# EAGLE schematic Main_V4.1_v37 (EAGLE 9.7.0)
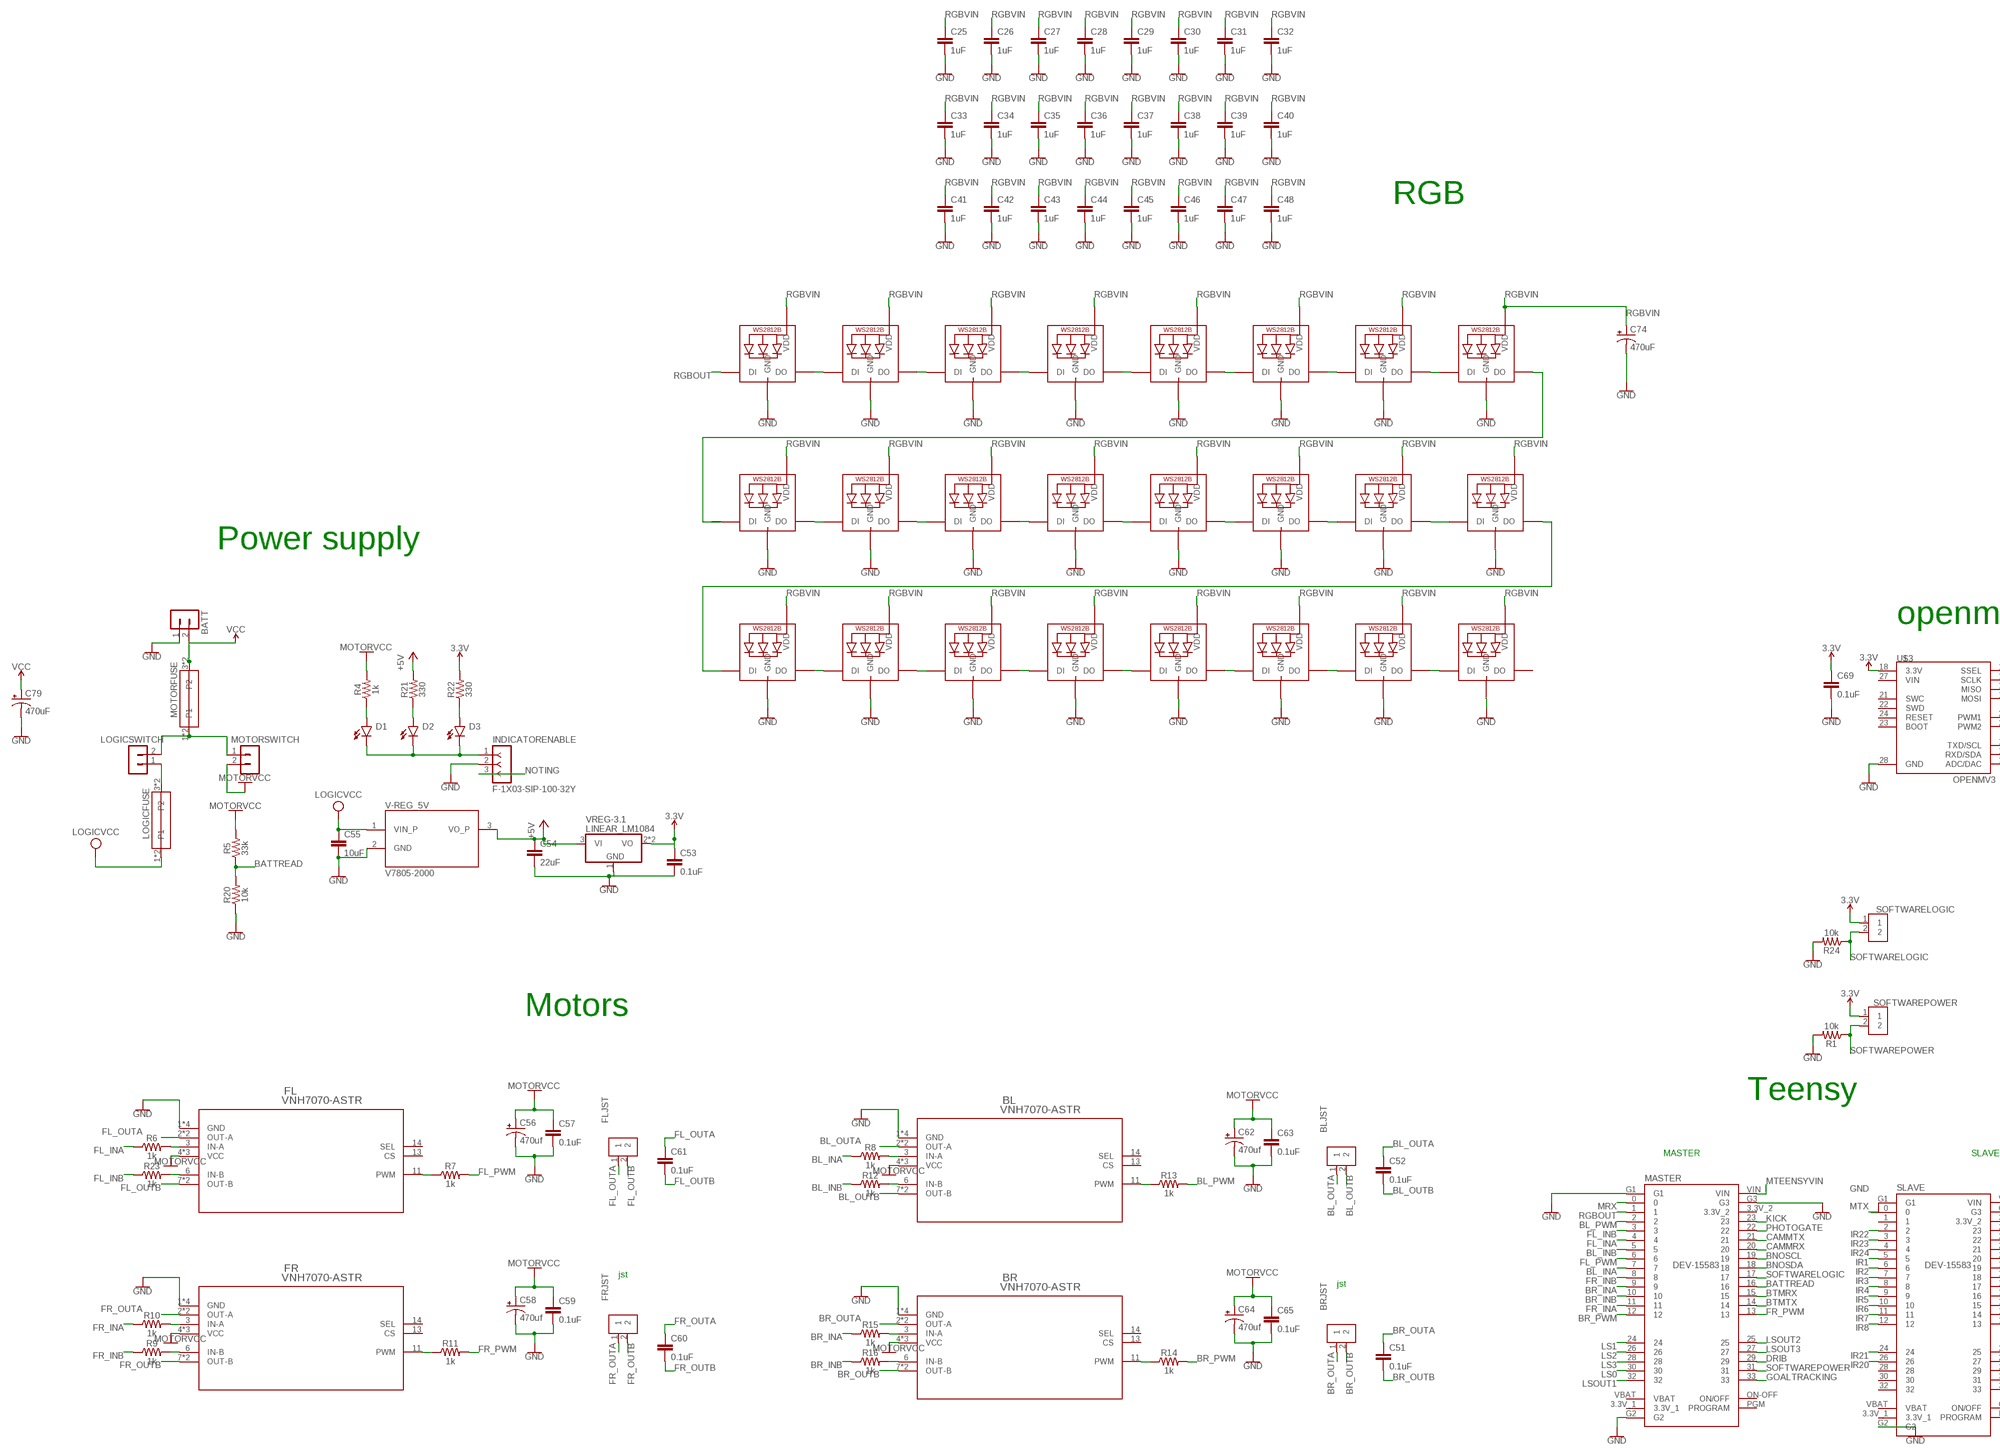
[diagram p0: schematic, sheet 1, part 1 of 2]
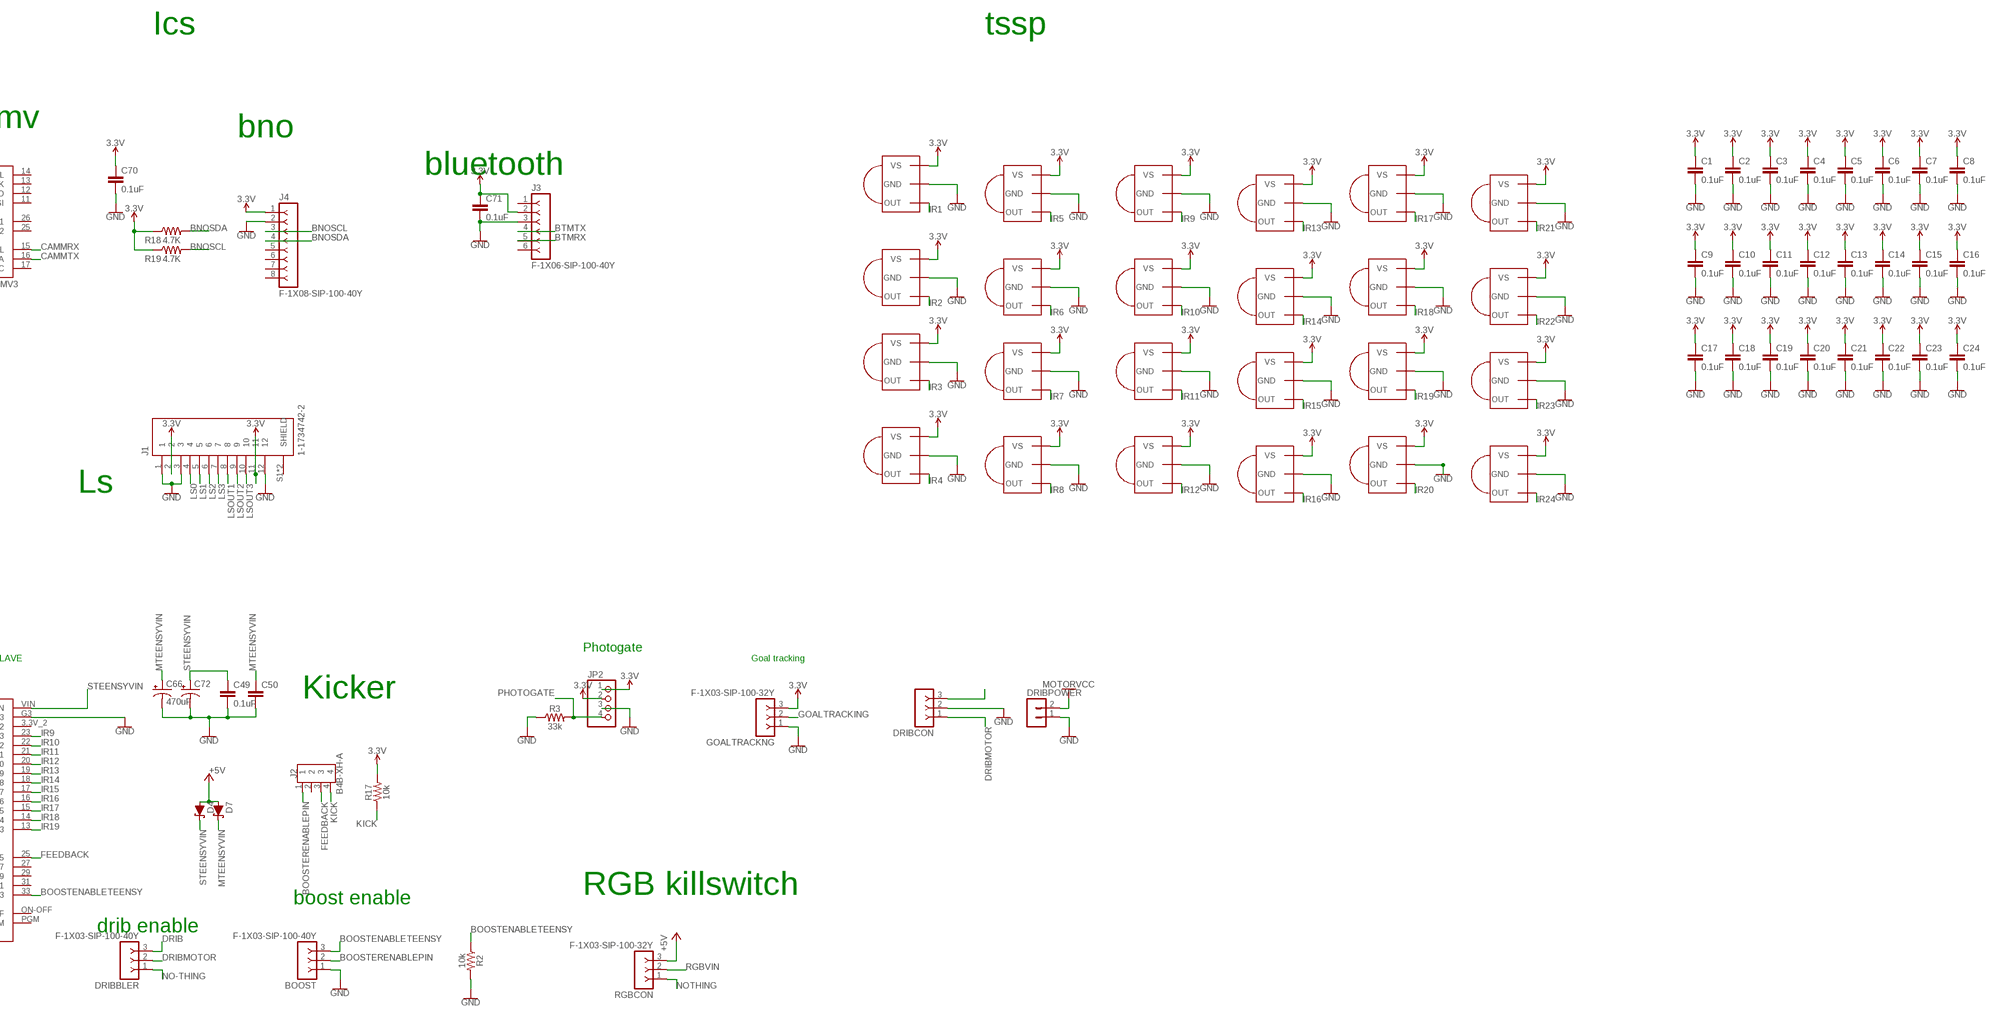
[diagram p1: schematic, sheet 1, part 2 of 2]

## Parts
BATT  B2P-VH-B  [B2P-VH]
BL  VNH7070-ASTR  [VNH7070-ASTR]
BLJST  B2B-XH-A  [B2B-XH-A]
BOOST  F-1X03-SIP-100-40Y  [SIP-100-03-40Y]
BR  VNH7070-ASTR  [VNH7070-ASTR]
BRJST  B2B-XH-A  [B2B-XH-A]
C1  0.1uF  0.1UF-0603-100V-10%  [0603]
C2  0.1uF  0.1UF-0603-100V-10%  [0603]
C3  0.1uF  0.1UF-0603-100V-10%  [0603]
C4  0.1uF  0.1UF-0603-100V-10%  [0603]
C5  0.1uF  0.1UF-0603-100V-10%  [0603]
C6  0.1uF  0.1UF-0603-100V-10%  [0603]
C7  0.1uF  0.1UF-0603-100V-10%  [0603]
C8  0.1uF  0.1UF-0603-100V-10%  [0603]
C9  0.1uF  0.1UF-0603-100V-10%  [0603]
C10  0.1uF  0.1UF-0603-100V-10%  [0603]
C11  0.1uF  0.1UF-0603-100V-10%  [0603]
C12  0.1uF  0.1UF-0603-100V-10%  [0603]
C13  0.1uF  0.1UF-0603-100V-10%  [0603]
C14  0.1uF  0.1UF-0603-100V-10%  [0603]
C15  0.1uF  0.1UF-0603-100V-10%  [0603]
C16  0.1uF  0.1UF-0603-100V-10%  [0603]
C17  0.1uF  0.1UF-0603-100V-10%  [0603]
C18  0.1uF  0.1UF-0603-100V-10%  [0603]
C19  0.1uF  0.1UF-0603-100V-10%  [0603]
C20  0.1uF  0.1UF-0603-100V-10%  [0603]
C21  0.1uF  0.1UF-0603-100V-10%  [0603]
C22  0.1uF  0.1UF-0603-100V-10%  [0603]
C23  0.1uF  0.1UF-0603-100V-10%  [0603]
C24  0.1uF  0.1UF-0603-100V-10%  [0603]
C25  1uF  0.1UF-0603-25V-(+80/-20%)  [0603]
C26  1uF  0.1UF-0603-25V-(+80/-20%)  [0603]
C27  1uF  0.1UF-0603-25V-(+80/-20%)  [0603]
C28  1uF  0.1UF-0603-25V-(+80/-20%)  [0603]
C29  1uF  0.1UF-0603-25V-(+80/-20%)  [0603]
C30  1uF  0.1UF-0603-25V-(+80/-20%)  [0603]
C31  1uF  0.1UF-0603-25V-(+80/-20%)  [0603]
C32  1uF  0.1UF-0603-25V-(+80/-20%)  [0603]
C33  1uF  0.1UF-0603-25V-(+80/-20%)  [0603]
C34  1uF  0.1UF-0603-25V-(+80/-20%)  [0603]
C35  1uF  0.1UF-0603-25V-(+80/-20%)  [0603]
C36  1uF  0.1UF-0603-25V-(+80/-20%)  [0603]
C37  1uF  0.1UF-0603-25V-(+80/-20%)  [0603]
C38  1uF  0.1UF-0603-25V-(+80/-20%)  [0603]
C39  1uF  0.1UF-0603-25V-(+80/-20%)  [0603]
C40  1uF  0.1UF-0603-25V-(+80/-20%)  [0603]
C41  1uF  0.1UF-0603-25V-(+80/-20%)  [0603]
C42  1uF  0.1UF-0603-25V-(+80/-20%)  [0603]
C43  1uF  0.1UF-0603-25V-(+80/-20%)  [0603]
C44  1uF  0.1UF-0603-25V-(+80/-20%)  [0603]
C45  1uF  0.1UF-0603-25V-(+80/-20%)  [0603]
C46  1uF  0.1UF-0603-25V-(+80/-20%)  [0603]
C47  1uF  0.1UF-0603-25V-(+80/-20%)  [0603]
C48  1uF  0.1UF-0603-25V-(+80/-20%)  [0603]
C49  0.1uF  0.1UF-0603-100V-10%  [0603]
C50  0.1uF  0.1UF-0603-100V-10%  [0603]
C51  0.1uF  0.1UF-0603-100V-10%  [0603]
C52  0.1uF  0.1UF-0603-100V-10%  [0603]
C53  0.1uF  0.1UF-0603-100V-10%  [0603]
C54  22uF  0.1UF-0603-100V-10%  [0603]
C55  10uF  0.1UF-0603-100V-10%  [0603]
C56  470uf  1000UF-RADIAL-5MM-35V-20%-KIT  [CPOL-RADIAL-5MM-10MM-KIT]
C57  0.1uF  0.1UF-0603-100V-10%  [0603]
C58  470uf  1000UF-RADIAL-5MM-35V-20%-KIT  [CPOL-RADIAL-5MM-10MM-KIT]
C59  0.1uF  0.1UF-0603-100V-10%  [0603]
C60  0.1uF  0.1UF-0603-100V-10%  [0603]
C61  0.1uF  0.1UF-0603-100V-10%  [0603]
C62  470uf  1000UF-RADIAL-5MM-35V-20%-KIT  [CPOL-RADIAL-5MM-10MM-KIT]
C63  0.1uF  0.1UF-0603-100V-10%  [0603]
C64  470uf  1000UF-RADIAL-5MM-35V-20%-KIT  [CPOL-RADIAL-5MM-10MM-KIT]
C65  0.1uF  0.1UF-0603-100V-10%  [0603]
C66  470uF  1000UF-RADIAL-5MM-35V-20%-KIT  [CPOL-RADIAL-5MM-10MM-KIT]
C69  0.1uF  0.1UF-0603-100V-10%  [0603]
C70  0.1uF  0.1UF-0603-100V-10%  [0603]
C71  0.1uF  0.1UF-0603-100V-10%  [0603]
C72  470uF  1000UF-RADIAL-5MM-35V-20%-KIT  [CPOL-RADIAL-5MM-10MM-KIT]
C74  470uF  1000UF-RADIAL-5MM-35V-20%-KIT  [CPOL-RADIAL-5MM-10MM-KIT]
C79  470uF  1000UF-RADIAL-5MM-35V-20%-KIT  [CPOL-RADIAL-5MM-10MM-KIT]
D1  CHIP-FLAT-Y_0603-0.55MM  [LEDC1608X55N_FLAT-Y]
D2  CHIP-FLAT-Y_0603-0.55MM  [LEDC1608X55N_FLAT-Y]
D3  CHIP-FLAT-Y_0603-0.55MM  [LEDC1608X55N_FLAT-Y]
D4  1A/40V/500mV  DIODE-SCHOTTKY-SS14  [SMA-DIODE]
D7  1A/40V/500mV  DIODE-SCHOTTKY-SS14  [SMA-DIODE]
DRIBBLER  F-1X03-SIP-100-40Y  [SIP-100-03-40Y]
DRIBCON  F-1X03-SIP-100-32Y  [SIP-100-03-32Y]
DRIBPOWER  B2P-VH-B  [B2P-VH]
FL  VNH7070-ASTR  [VNH7070-ASTR]
FLJST  B2B-XH-A  [B2B-XH-A]
FR  VNH7070-ASTR  [VNH7070-ASTR]
FRJST  B2B-XH-A  [B2B-XH-A]
GOALTRACKNG  F-1X03-SIP-100-32Y  [SIP-100-03-32Y]
INDICATORENABLE  F-1X03-SIP-100-32Y  [SIP-100-03-32Y]
IR1  TSSP58038  [MINICAST]
IR2  TSSP58038  [MINICAST]
IR3  TSSP58038  [MINICAST]
IR4  TSSP58038  [MINICAST]
IR5  TSSP58038  [MINICAST]
IR6  TSSP58038  [MINICAST]
IR7  TSSP58038  [MINICAST]
IR8  TSSP58038  [MINICAST]
IR9  TSSP58038  [MINICAST]
IR10  TSSP58038  [MINICAST]
IR11  TSSP58038  [MINICAST]
IR12  TSSP58038  [MINICAST]
IR13  TSSP58038  [MINICAST]
IR14  TSSP58038  [MINICAST]
IR15  TSSP58038  [MINICAST]
IR16  TSSP58038  [MINICAST]
IR17  TSSP58038  [MINICAST]
IR18  TSSP58038  [MINICAST]
IR19  TSSP58038  [MINICAST]
IR20  TSSP58038  [MINICAST]
IR21  TSSP58038  [MINICAST]
IR22  TSSP58038  [MINICAST]
IR23  TSSP58038  [MINICAST]
IR24  TSSP58038  [MINICAST]
J1  1-1734742-2  [TE_1-1734742-2]
J2  B4B-XH-A  [B4B-XH-A]
J3  F-1X06-SIP-100-40Y  [SIP-100-06-40Y]
J4  F-1X08-SIP-100-40Y  [SIP-100-08-40Y]
JP2  PINHD-1X4  [1X04]
LED1  WS2812B_5050N  [WS2812B-NARROW]
LED2  WS2812B_5050N  [WS2812B-NARROW]
LED3  WS2812B_5050N  [WS2812B-NARROW]
LED4  WS2812B_5050N  [WS2812B-NARROW]
LED5  WS2812B_5050N  [WS2812B-NARROW]
LED6  WS2812B_5050N  [WS2812B-NARROW]
LED7  WS2812B_5050N  [WS2812B-NARROW]
LED8  WS2812B_5050N  [WS2812B-NARROW]
LED9  WS2812B_5050N  [WS2812B-NARROW]
LED10  WS2812B_5050N  [WS2812B-NARROW]
LED11  WS2812B_5050N  [WS2812B-NARROW]
LED12  WS2812B_5050N  [WS2812B-NARROW]
LED13  WS2812B_5050N  [WS2812B-NARROW]
LED14  WS2812B_5050N  [WS2812B-NARROW]
LED15  WS2812B_5050N  [WS2812B-NARROW]
LED16  WS2812B_5050N  [WS2812B-NARROW]
LED17  WS2812B_5050N  [WS2812B-NARROW]
LED18  WS2812B_5050N  [WS2812B-NARROW]
LED19  WS2812B_5050N  [WS2812B-NARROW]
LED20  WS2812B_5050N  [WS2812B-NARROW]
LED21  WS2812B_5050N  [WS2812B-NARROW]
LED22  WS2812B_5050N  [WS2812B-NARROW]
LED23  WS2812B_5050N  [WS2812B-NARROW]
LED24  WS2812B_5050N  [WS2812B-NARROW]
LOGICFUSE  3568-FUSEHOLDER  [3568-FUSEHOLDER]
LOGICSWITCH  B2P-VH-B  [B2P-VH]
MASTER  DEV-15583  [MODULE_DEV-15583]
MOTORFUSE  3568-FUSEHOLDER  [3568-FUSEHOLDER]
MOTORSWITCH  B2P-VH-B  [B2P-VH]
R1  10k  10KOHM-0603-1/10W-1%  [0603]
R2  10k  1KOHM-0603-1/10W-1%  [0603]
R3  33k  0.1OHM-0603-1/3W-1%  [0603]
R4  1k  1KOHM-0603-1/10W-1%  [0603]
R5  33k  30.1KOHM-0603-1/10W-1%  [0603]
R6  1k  0.1OHM-0603-1/3W-1%  [0603]
R7  1k  0.1OHM-0603-1/3W-1%  [0603]
R8  1k  0.1OHM-0603-1/3W-1%  [0603]
R9  1k  0.1OHM-0603-1/3W-1%  [0603]
R10  1k  0.1OHM-0603-1/3W-1%  [0603]
R11  1k  0.1OHM-0603-1/3W-1%  [0603]
R12  1k  0.1OHM-0603-1/3W-1%  [0603]
R13  1k  0.1OHM-0603-1/3W-1%  [0603]
R14  1k  0.1OHM-0603-1/3W-1%  [0603]
R15  1k  0.1OHM-0603-1/3W-1%  [0603]
R16  1k  0.1OHM-0603-1/3W-1%  [0603]
R17  10k  10KOHM-0603-1/10W-1%  [0603]
R18  4.7K  30.1KOHM-0603-1/10W-1%  [0603]
R19  4.7K  30.1KOHM-0603-1/10W-1%  [0603]
R20  10k  30.1KOHM-0603-1/10W-1%  [0603]
R21  330  1KOHM-0603-1/10W-1%  [0603]
R22  330  1KOHM-0603-1/10W-1%  [0603]
R23  1k  0.1OHM-0603-1/3W-1%  [0603]
R24  10k  10KOHM-0603-1/10W-1%  [0603]
RGBCON  F-1X03-SIP-100-32Y  [SIP-100-03-32Y]
SLAVE  DEV-15583  [MODULE_DEV-15583]
SOFTWARELOGIC  B2B-XH-A  [B2B-XH-A]
SOFTWAREPOWER  B2B-XH-A  [B2B-XH-A]
U$3  OPENMV3  [OPENMV3]
V-REG_5V  V7805-2000  [CONV_V7805-2000]
VREG-3.1  LINEAR_LM1084  LINEAR_LM340S-05  [LINEAR_TO263-3]

## Nets
3.3V: C1.1 C2.1 C3.1 C4.1 C5.1 C6.1 C7.1 C8.1 C9.1 C10.1 C11.1 C12.1 C13.1 C14.1 C15.1 C16.1 C17.1 C18.1 C19.1 C20.1 C21.1 C22.1 C23.1 C24.1 C53.1 C69.1 C70.1 C71.1 GOALTRACKNG.3 IR1.3(VS) IR2.3(VS) IR3.3(VS) IR4.3(VS) IR5.3(VS) IR6.3(VS) IR7.3(VS) IR8.3(VS) IR9.3(VS) IR10.3(VS) IR11.3(VS) IR12.3(VS) IR13.3(VS) IR14.3(VS) IR15.3(VS) IR16.3(VS) IR17.3(VS) IR18.3(VS) IR19.3(VS) IR20.3(VS) IR21.3(VS) IR22.3(VS) IR23.3(VS) IR24.3(VS) J1.2 J1.11 J3.2 J4.1 JP2.1 JP2.2 R17.2 R18.1 R19.1 R22.2 SOFTWARELOGIC.1 SOFTWAREPOWER.1 U$3.18(3.3V) VREG-3.1.2(VO) VREG-3.1.TAB(VO)
+5V: C54.1 D4.A D7.A R21.2 RGBCON.3 V-REG_5V.3(VO_P) VREG-3.1.3(VI)
BATTREAD: MASTER.16 R5.1 R20.2
BL_INA: MASTER.7 R8.1
BL_INB: MASTER.5 R12.1
BL_OUTA: BL.2(OUT-A) BL.15(OUT-A) BLJST.1 C52.1
BL_OUTB: BL.7(OUT-B) BL.10(OUT-B) BLJST.2 C52.2
BL_PWM: MASTER.2 R13.2
BNOSCL: J4.3 MASTER.19 R19.2
BNOSDA: J4.4 MASTER.18 R18.2
BOOSTENABLETEENSY: BOOST.3 R2.1 SLAVE.33
BOOSTERENABLEPIN: BOOST.2 J2.1
BR_INA: MASTER.9 R15.1
BR_INB: MASTER.10 R16.1
BR_OUTA: BR.2(OUT-A) BR.15(OUT-A) BRJST.1 C51.1
BR_OUTB: BR.7(OUT-B) BR.10(OUT-B) BRJST.2 C51.2
BR_PWM: MASTER.12 R14.2
BTMRX: J3.5 MASTER.15
BTMTX: J3.4 MASTER.14
CAMMRX: MASTER.20 U$3.15(TXD/SCL)
CAMMTX: MASTER.21 U$3.16(RXD/SDA)
DRIB: DRIBBLER.3 MASTER.29
DRIBMOTOR: DRIBBLER.2 DRIBCON.1
FEEDBACK: J2.3 SLAVE.25
FL_INA: MASTER.4 R6.1
FL_INB: MASTER.3 R23.1
FL_OUTA: C61.1 FL.2(OUT-A) FL.15(OUT-A) FLJST.1
FL_OUTB: C61.2 FL.7(OUT-B) FL.10(OUT-B) FLJST.2
FL_PWM: MASTER.6 R7.2
FR_INA: MASTER.11 R10.1
FR_INB: MASTER.8 R9.1
FR_OUTA: C60.1 FR.2(OUT-A) FR.15(OUT-A) FRJST.1
FR_OUTB: C60.2 FR.7(OUT-B) FR.10(OUT-B) FRJST.2
FR_PWM: MASTER.13 R11.2
GND: BATT.1 BL.1(GND) BL.8(GND) BL.9(GND) BL.16(GND) BOOST.1 BR.1(GND) BR.8(GND) BR.9(GND) BR.16(GND) C1.2 C2.2 C3.2 C4.2 C5.2 C6.2 C7.2 C8.2 C9.2 C10.2 C11.2 C12.2 C13.2 C14.2 C15.2 C16.2 C17.2 C18.2 C19.2 C20.2 C21.2 C22.2 C23.2 C24.2 C25.2 C26.2 C27.2 C28.2 C29.2 C30.2 C31.2 C32.2 C33.2 C34.2 C35.2 C36.2 C37.2 C38.2 C39.2 C40.2 C41.2 C42.2 C43.2 C44.2 C45.2 C46.2 C47.2 C48.2 C49.2 C50.2 C53.2 C54.2 C55.2 C56.- C57.2 C58.- C59.2 C62.- C63.2 C64.- C65.2 C66.- C69.2 C70.2 C71.2 C72.- C74.- C79.- DRIBCON.2 DRIBPOWER.1 FL.1(GND) FL.8(GND) FL.9(GND) FL.16(GND) FR.1(GND) FR.8(GND) FR.9(GND) FR.16(GND) GOALTRACKNG.1 INDICATORENABLE.2 IR1.2(GND) IR2.2(GND) IR3.2(GND) IR4.2(GND) IR5.2(GND) IR6.2(GND) IR7.2(GND) IR8.2(GND) IR9.2(GND) IR10.2(GND) IR11.2(GND) IR12.2(GND) IR13.2(GND) IR14.2(GND) IR15.2(GND) IR16.2(GND) IR17.2(GND) IR18.2(GND) IR19.2(GND) IR20.2(GND) IR21.2(GND) IR22.2(GND) IR23.2(GND) IR24.2(GND) J1.1 J1.3 J1.12 J3.3 J4.2 JP2.3 LED1.3-GND(GND) LED2.3-GND(GND) LED3.3-GND(GND) LED4.3-GND(GND) LED5.3-GND(GND) LED6.3-GND(GND) LED7.3-GND(GND) LED8.3-GND(GND) LED9.3-GND(GND) LED10.3-GND(GND) LED11.3-GND(GND) LED12.3-GND(GND) LED13.3-GND(GND) LED14.3-GND(GND) LED15.3-GND(GND) LED16.3-GND(GND) LED17.3-GND(GND) LED18.3-GND(GND) LED19.3-GND(GND) LED20.3-GND(GND) LED21.3-GND(GND) LED22.3-GND(GND) LED23.3-GND(GND) LED24.3-GND(GND) MASTER.G1 MASTER.G2 MASTER.G3 R1.2 R2.2 R3.1 R20.1 R24.2 SLAVE.G1 SLAVE.G2 SLAVE.G3 U$3.28(GND) V-REG_5V.2(GND) VREG-3.1.1(GND)
GOALTRACKING: GOALTRACKNG.2 MASTER.33
IR1: IR1.1(OUT) SLAVE.5
IR2: IR2.1(OUT) SLAVE.6
IR3: IR3.1(OUT) SLAVE.7
IR4: IR4.1(OUT) SLAVE.8
IR5: IR5.1(OUT) SLAVE.9
IR6: IR6.1(OUT) SLAVE.10
IR7: IR7.1(OUT) SLAVE.11
IR8: IR8.1(OUT) SLAVE.12
IR9: IR9.1(OUT) SLAVE.23
IR10: IR10.1(OUT) SLAVE.22
IR11: IR11.1(OUT) SLAVE.21
IR12: IR12.1(OUT) SLAVE.20
IR13: IR13.1(OUT) SLAVE.19
IR14: IR14.1(OUT) SLAVE.18
IR15: IR15.1(OUT) SLAVE.17
IR16: IR16.1(OUT) SLAVE.16
IR17: IR17.1(OUT) SLAVE.15
IR18: IR18.1(OUT) SLAVE.14
IR19: IR19.1(OUT) SLAVE.13
IR20: IR20.1(OUT) SLAVE.26
IR21: IR21.1(OUT) SLAVE.24
IR22: IR22.1(OUT) SLAVE.2
IR23: IR23.1(OUT) SLAVE.3
IR24: IR24.1(OUT) SLAVE.4
KICK: J2.4 MASTER.23 R17.1
LOGICVCC: C55.1 LOGICFUSE.1 LOGICFUSE.2(P1) V-REG_5V.1(VIN_P)
LS0: J1.4 MASTER.30
LS1: J1.5 MASTER.24
LS2: J1.6 MASTER.26
LS3: J1.7 MASTER.28
LSOUT1: J1.8 MASTER.32
LSOUT2: J1.9 MASTER.25
LSOUT3: J1.10 MASTER.27
MOTORVCC: BL.4(VCC) BL.5(VCC) BL.12(VCC) BR.4(VCC) BR.5(VCC) BR.12(VCC) C56.+ C57.1 C58.+ C59.1 C62.+ C63.1 C64.+ C65.1 DRIBPOWER.2 FL.4(VCC) FL.5(VCC) FL.12(VCC) FR.4(VCC) FR.5(VCC) FR.12(VCC) MOTORSWITCH.2 R4.2 R5.2
MRX: MASTER.0
MTEENSYVIN: C50.1 C66.+ D7.C MASTER.VIN
MTX: SLAVE.0
N$1: LOGICSWITCH.2 MOTORFUSE.1 MOTORFUSE.2(P1) MOTORSWITCH.1
N$2: D1.C D2.C D3.C INDICATORENABLE.1
N$3: FL.3(IN-A) R6.2
N$4: D1.A R4.1
N$5: LOGICFUSE.3(P2) LOGICFUSE.4(P2) LOGICSWITCH.1
N$6: D2.A R21.1
N$7: FL.6(IN-B) R23.2
N$8: FL.11(PWM) R7.1
N$9: FR.3(IN-A) R10.2
N$10: FR.11(PWM) R11.1
N$11: FR.6(IN-B) R9.2
N$12: BL.3(IN-A) R8.2
N$13: BL.11(PWM) R13.1
N$14: BL.6(IN-B) R12.2
N$15: BR.3(IN-A) R15.2
N$16: BR.11(PWM) R14.1
N$17: BR.6(IN-B) R16.2
N$18: D3.A R22.1
N$19: LED19.2-DOUT(DO) LED20.4-DIN(DI)
N$20: LED23.2-DOUT(DO) LED24.4-DIN(DI)
N$21: LED22.2-DOUT(DO) LED23.4-DIN(DI)
N$22: LED21.2-DOUT(DO) LED22.4-DIN(DI)
N$23: LED18.2-DOUT(DO) LED19.4-DIN(DI)
N$24: LED15.2-DOUT(DO) LED16.4-DIN(DI)
N$25: LED3.2-DOUT(DO) LED4.4-DIN(DI)
N$26: LED9.2-DOUT(DO) LED10.4-DIN(DI)
N$27: LED10.2-DOUT(DO) LED11.4-DIN(DI)
N$30: LED12.2-DOUT(DO) LED13.4-DIN(DI)
N$31: LED13.2-DOUT(DO) LED14.4-DIN(DI)
N$32: LED14.2-DOUT(DO) LED15.4-DIN(DI)
N$33: LED6.2-DOUT(DO) LED7.4-DIN(DI)
N$34: LED8.2-DOUT(DO) LED9.4-DIN(DI)
N$35: LED16.2-DOUT(DO) LED17.4-DIN(DI)
N$36: LED5.2-DOUT(DO) LED6.4-DIN(DI)
N$37: LED4.2-DOUT(DO) LED5.4-DIN(DI)
N$38: LED2.2-DOUT(DO) LED3.4-DIN(DI)
N$39: LED1.2-DOUT(DO) LED2.4-DIN(DI)
N$40: LED11.2-DOUT(DO) LED12.4-DIN(DI)
N$41: LED7.2-DOUT(DO) LED8.4-DIN(DI)
N$46: DRIBCON.3
N$50: LED17.2-DOUT(DO) LED18.4-DIN(DI)
N$55: LED20.2-DOUT(DO) LED21.4-DIN(DI)
NO-THING: DRIBBLER.1
NOTHING: RGBCON.1
NOTING: INDICATORENABLE.3
PHOTOGATE: JP2.4 MASTER.22 R3.2
RGBOUT: LED1.4-DIN(DI) MASTER.1
RGBVIN: C25.1 C26.1 C27.1 C28.1 C29.1 C30.1 C31.1 C32.1 C33.1 C34.1 C35.1 C36.1 C37.1 C38.1 C39.1 C40.1 C41.1 C42.1 C43.1 C44.1 C45.1 C46.1 C47.1 C48.1 C74.+ LED1.1-VDD(VDD) LED2.1-VDD(VDD) LED3.1-VDD(VDD) LED4.1-VDD(VDD) LED5.1-VDD(VDD) LED6.1-VDD(VDD) LED7.1-VDD(VDD) LED8.1-VDD(VDD) LED9.1-VDD(VDD) LED10.1-VDD(VDD) LED11.1-VDD(VDD) LED12.1-VDD(VDD) LED13.1-VDD(VDD) LED14.1-VDD(VDD) LED15.1-VDD(VDD) LED16.1-VDD(VDD) LED17.1-VDD(VDD) LED18.1-VDD(VDD) LED19.1-VDD(VDD) LED20.1-VDD(VDD) LED21.1-VDD(VDD) LED22.1-VDD(VDD) LED23.1-VDD(VDD) LED24.1-VDD(VDD) RGBCON.2
SOFTWARELOGIC: MASTER.17 R24.1 SOFTWARELOGIC.2
SOFTWAREPOWER: MASTER.31 R1.1 SOFTWAREPOWER.2
STEENSYVIN: C49.1 C72.+ D4.C SLAVE.VIN
VCC: BATT.2 C79.+ MOTORFUSE.3(P2) MOTORFUSE.4(P2)
Unconnected: BL.13(CS) BL.14(SEL) BR.13(CS) BR.14(SEL) FL.13(CS) FL.14(SEL) FR.13(CS) FR.14(SEL) J1.S1(SHIELD) J1.S2(SHIELD) J2.2 J3.1 J3.6 J4.5 J4.6 J4.7 J4.8 LED24.2-DOUT(DO) MASTER.ON-OFF(ON/OFF) MASTER.PGM(PROGRAM) SLAVE.1 SLAVE.27 SLAVE.28 SLAVE.29 SLAVE.30 SLAVE.31 SLAVE.32 SLAVE.ON-OFF(ON/OFF) SLAVE.PGM(PROGRAM) U$3.11(MOSI) U$3.12(MISO) U$3.13(SCLK) U$3.14(SSEL) U$3.17(ADC/DAC) U$3.21(SWC) U$3.22(SWD) U$3.23(BOOT) U$3.24(RESET) U$3.25(PWM2) U$3.26(PWM1)

## Notes on the sheet
- RGB
- rgb
- Ics | tssp
- Power supply
- openmv | bno
- bluetooth
- Ls
- Motors
- Teensy
- Photogate
- MASTER | SLAVE | Goal tracking
- Kicker
- jst
- jst
- RGB killswitch
- boost enable
- drib enable

## Power pins joined to a net without a drawn wire
3.3V_1: MASTER.3.3V_1 SLAVE.3.3V_1
3.3V_2: MASTER.3.3V_2 SLAVE.3.3V_2
VBAT: MASTER.VBAT SLAVE.VBAT
VIN: U$3.27(VIN)

## Library data of the parts
BATT DRIBPOWER LOGICSWITCH MOTORSWITCH = con-JST VH:B2P-VH: JST VH Series header 3.96mm pitch disconnectable crimp style connectors, vertical (side entry type), 2 pins
BL BR FL FR = VNH7070-ASTR:VNH7070-ASTR
BLJST BRJST FLJST FRJST SOFTWARELOGIC SOFTWAREPOWER = Connector:B2B-XH-A: XH Connector Top Entry - 2POS Details see: Datasheet <http://www.jst-mfg.com/product/pdf/eng/eXH.pdf>; CATEGORY: Header; DESCRIPTION: Connector Header Through Hole 2 position 0.098" (2.50mm); MANUFACTURER: JST Sales America Inc.; MPN: B2B-XH-A(LF)(SN); OPERATING_TEMPERATURE: -25°C ~ 85°C; PART_STATUS: ACTIVE; PITCH: 0.098" (2.50mm); ROHS_COMPLIANCE: ROHS3 Compliant; SERIES: XH; SUB_CATEGORY: Rectangular Connectors; TYPE: Header, Male Pin, Board to Cable/Wire, Through Hole
BOOST DRIBBLER DRIBCON GOALTRACKNG INDICATORENABLE RGBCON = con-headers-jp:F-1X03-: FEMALE HEADER
C1-C24 C49-C53 C57 C59-C61 C63 C65 C69-C71 = SparkFun-Capacitors:0.1UF: 0.1µF ceramic capacitors A capacitor is a passive two-terminal electrical component used to store electrical energy temporarily in an electric field.; PROD_ID: CAP-08390
C25-C48 = SparkFun-Capacitors:0.1UF: 0.1µF ceramic capacitors A capacitor is a passive two-terminal electrical component used to store electrical energy temporarily in an electric field.; PROD_ID: CAP-00810; VALUE: 0.1uF
C54 C55 = SparkFun-Capacitors:0.1UF: 0.1µF ceramic capacitors A capacitor is a passive two-terminal electrical component used to store electrical energy temporarily in an electric field.; PROD_ID: CAP-08390; VALUE: 0.1uF
C56 C58 C62 C64 C66 C72 C74 C79 = SparkFun-Capacitors:1000UF: 1,000µF/1mF ceramic capacitors A capacitor is a passive two-terminal electrical component used to store electrical energy temporarily in an electric field. CAP-08070; PROD_ID: CAP-09538; VALUE: 1mf
D1-D3 = LED:CHIP-FLAT-Y; CATEGORY: LED; COLOR: YELLOW; DESCRIPTION: CHIP LED FLAT; SUB-CATEGORY: CHIP; TYPE: FLAT_TOP; VALUE: LED_YELLOW
D4 D7 = Semi:DIODE-SCHOTTKY: Schottky diode A Schottky diode is a semiconductor diode which has a low forward voltage drop and a very fast switching action.; PROD_ID: DIO-08053
IR1-IR24 = IR Receivers:TSSP58038: IR Receiver Module for Light Barrier Systems datasheet <http://www.vishay.com/docs/82479/tssp58038.pdf>
J1 = 12pinveritcalffccon:1-1734742-2: Check availability <https://pricing.snapeda.com/parts/1-1734742-2/TE%20Connectivity/view-part?ref=eda>; AVAILABILITY: In Stock; CHECK_PRICES: https://www.snapeda.com/parts/1-1734742-2/TE+Connectivity+AMP+Connectors/view-part/?ref=eda; COMMENT: 1-1734742-2; DESCRIPTION: FPC Series 1mm Pitch 12 Way Straight Female FPC Connector, ZIF Vertical Contact | TE Connectivity 1-1734742-2; EU_ROHS_COMPLIANCE: Compliant; MF: TE Connectivity; MP: 1-1734742-2; PACKAGE: None; PRICE: None; SNAPEDA_LINK: https://www.snapeda.com/parts/1-1734742-2/TE+Connectivity+AMP+Connectors/view-part/?ref=snap
J2 = Connector:B4B-XH-A: XH Connector Top Entry - 4POS Details see: Datasheet <http://www.jst-mfg.com/product/pdf/eng/eXH.pdf>; CATEGORY: Header; DSECRIPTION: Connector Header Through Hole 4 position 0.098" (2.50mm); MANUFACTURER: JST Sales America Inc.; MPN: B4B-XH-A(LF)(SN); OPERATING_TEMPERATURE: -25 C to 85 C; PART_STATUS: ACTIVE; PITCH: 0.098" (2.50mm); ROHS_COMPLIANCE: ROHS3 Compliant; SERIES: XH; SUB_CATEGORY: Rectangular Connectors; TYPE: Header, Male Pin, Board to Cable/Wire, Through Hole
J3 = con-headers-jp:F-1X06-: FEMALE HEADER
J4 = con-headers-jp:F-1X08-: FEMALE HEADER
JP2 = pinhead:PINHD-1X4: PIN HEADER
LED1-LED24 = RGBLED:WS2812B: Check availability <https://pricing.snapeda.com/parts/WS2812B/Worldsemi/view-part?ref=eda>; AVAILABILITY: Not in stock; CHECK_PRICES: https://www.snapeda.com/parts/WS2812B/Worldsemi/view-part/?ref=eda; DESCRIPTION: Intelligent control LED integrated light source; MF: Worldsemi; MP: WS2812B; PACKAGE: None; PRICE: None; SNAPEDA_LINK: https://www.snapeda.com/parts/WS2812B/Worldsemi/view-part/?ref=snap
LOGICFUSE MOTORFUSE = ROBO:3568-FUSEHOLDER
MASTER SLAVE = Teensy 4.0 library:DEV-15583: RT1062 Teensy 4.0 i.MX ARM® Cortex®-M7 MPU Embedded Evaluation Board Check availability <https://pricing.snapeda.com/parts/DEV-15583/SparkFun%20Electronics/view-part?ref=eda>; AVAILABILITY: In Stock; CHECK_PRICES: https://www.snapeda.com/parts/DEV-15583/SparkFun+Electronics/view-part/?ref=eda; DESCRIPTION: RT1062 Teensy 4.0 series ARM® Cortex®-M7 MPU Embedded Evaluation Board; MF: SparkFun Electronics; MP: DEV-15583; PACKAGE: None; PRICE: None; PURCHASE-URL: https://www.snapeda.com/api/url_track_click_mouser/?unipart_id=4001229&manufacturer=SparkFun Electronics&part_name=DEV-15583&search_term=None; SNAPEDA_LINK: https://www.snapeda.com/parts/DEV-15583/SparkFun+Electronics/view-part/?ref=snap
R1 R17 R24 = SparkFun-Resistors:10KOHM: 10kΩ resistor A resistor is a passive two-terminal electrical component that implements electrical resistance as a circuit element. Resistors act to reduce current flow, and, at the same time, act to lower voltage levels within circuits. - Wikipedia; PROD_ID: RES-00824
R2 R21 R22 = SparkFun-Resistors:1KOHM: 1kΩ resistor A resistor is a passive two-terminal electrical component that implements electrical resistance as a circuit element. Resistors act to reduce current flow, and, at the same time, act to lower voltage levels within circuits. - Wikipedia; PROD_ID: RES-07856; VALUE: 1k
R3 R6-R16 R23 = SparkFun-Resistors:0.1OHM: 0.1Ω resistor A resistor is a passive two-terminal electrical component that implements electrical resistance as a circuit element. Resistors act to reduce current flow, and, at the same time, act to lower voltage levels within circuits. - Wikipedia; PROD_ID: RES-15715; VALUE: 0.1
R4 = SparkFun-Resistors:1KOHM: 1kΩ resistor A resistor is a passive two-terminal electrical component that implements electrical resistance as a circuit element. Resistors act to reduce current flow, and, at the same time, act to lower voltage levels within circuits. - Wikipedia; PROD_ID: RES-07856
R5 R18-R20 = SparkFun-Resistors:30.1KOHM: 30.1kΩ resistor A resistor is a passive two-terminal electrical component that implements electrical resistance as a circuit element. Resistors act to reduce current flow, and, at the same time, act to lower voltage levels within circuits. - Wikipedia; PROD_ID: RES-14690; VALUE: 30.1k
U$3 = OpenMV:OPENMV3
V-REG_5V = V7805-2000:V7805-2000; MANUFACTURER: CUI INC; PARTREV: 1.03; STANDARD: MANUFACTURER RECOMMENDATIONS
VREG-3.1 = Main:LINEAR_LM340?-*: Positive VOLTAGE REGULATOR Source: http://cache.national.com/ds/LM/LM340.pdf